# EAGLE schematic 4gewinnt_01 (EAGLE 6.6.0)
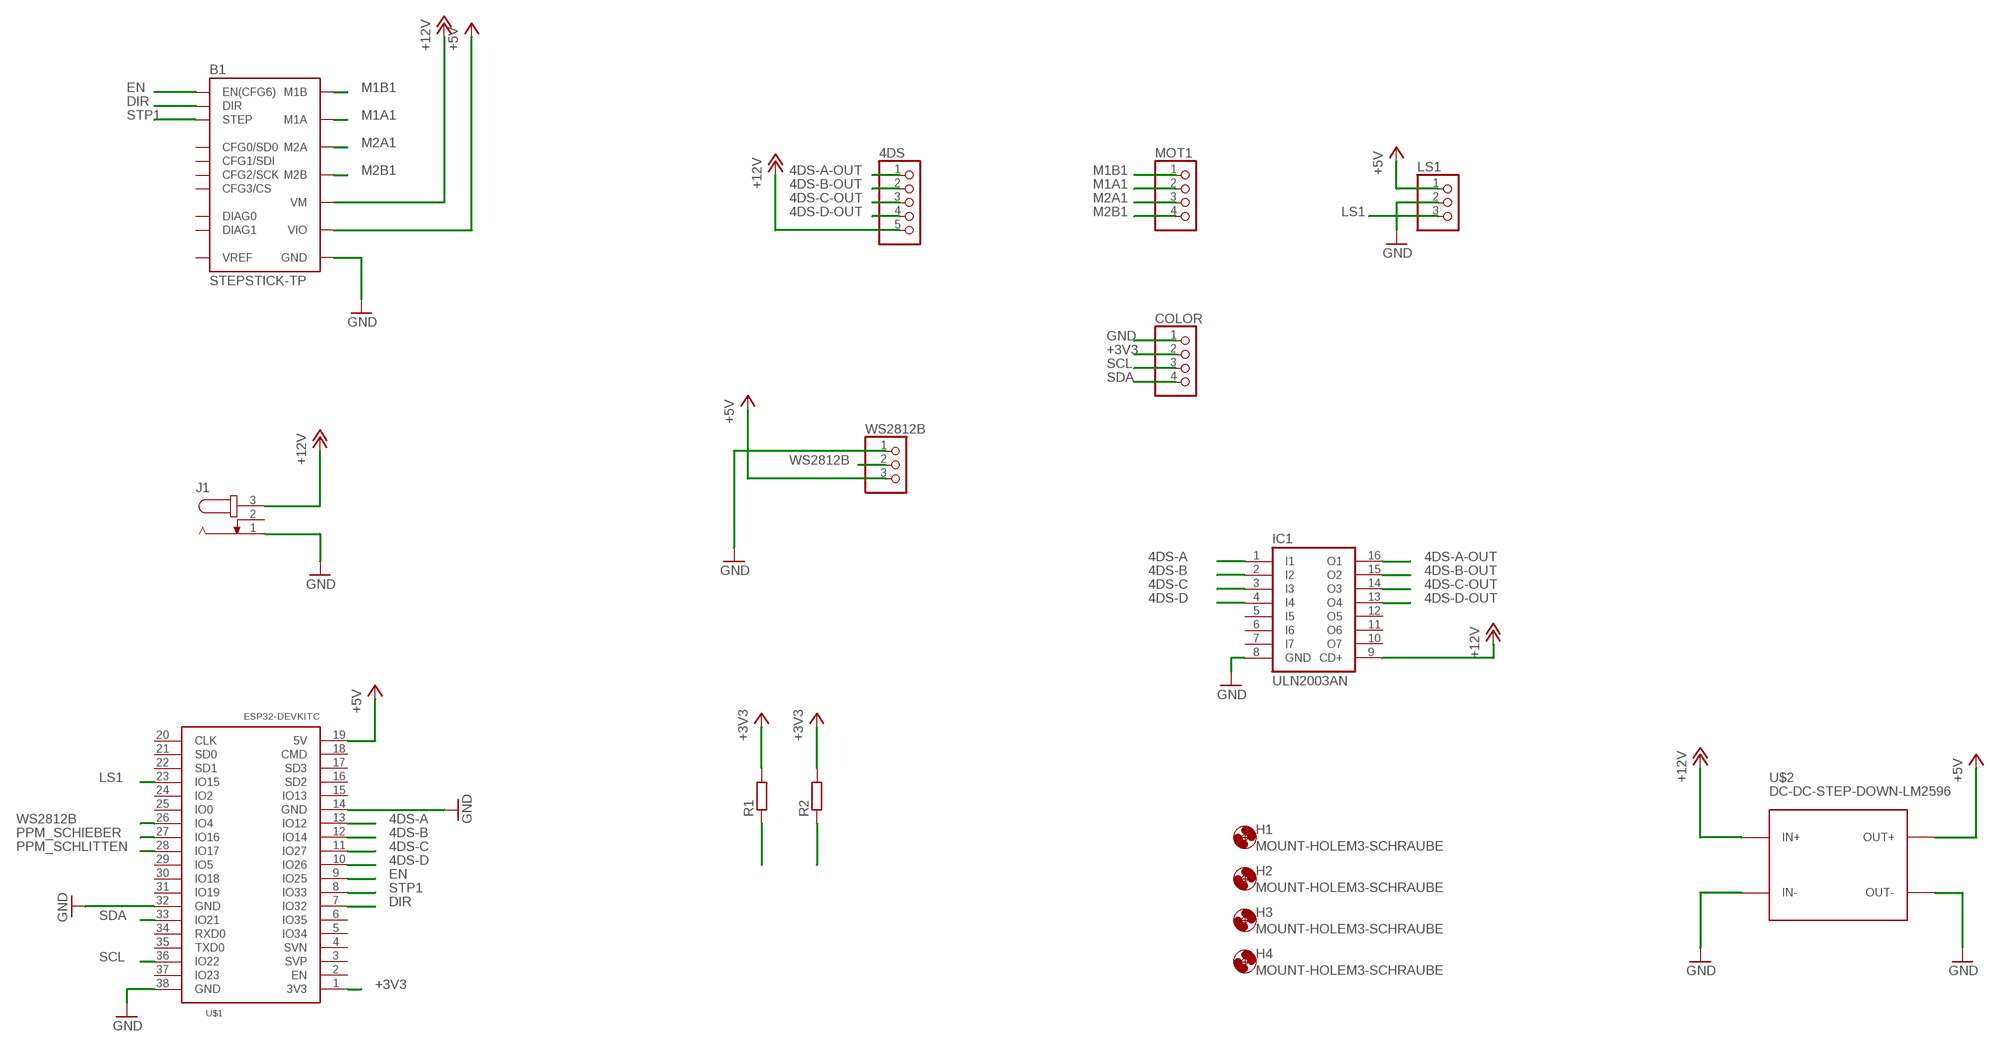
[diagram p0: schematic, sheet 1]

## Parts
4DS  PINHD-1X5  [1X05]
B1  STEPSTICK-TP  [STEPSTICK_TP]
COLOR  PINHD-1X4  [1X04]
H1  MOUNT-HOLEM3-SCHRAUBE  [M3-SCHRAUBE]
H2  MOUNT-HOLEM3-SCHRAUBE  [M3-SCHRAUBE]
H3  MOUNT-HOLEM3-SCHRAUBE  [M3-SCHRAUBE]
H4  MOUNT-HOLEM3-SCHRAUBE  [M3-SCHRAUBE]
IC1  ULN2003AN  [DIL16]
J1  JACK-PLUG2  [DC5.5-2.5]
LS1  PINHD-1X3  [1X03]
MOT1  PINHD-1X4  [1X04]
R1  R-EU_0207/15  [0207/15]
R2  R-EU_0207/15  [0207/15]
U$1  ESP32DEVKITCAZDELIVERY-ESP32  [AZDELIVERY-ESP32]
U$2  DC-DC-STEP-DOWN-LM2596  [DC-DC-STEP-DOWN-LM2596]
WS2812B  PINHD-1X3  [1X03]

## Nets
4DS-A: IC1.1(I1) U$1.13(IO12)
4DS-A-OUT: 4DS.1 IC1.16(O1)
4DS-B: IC1.2(I2) U$1.12(IO14)
4DS-B-OUT: 4DS.2 IC1.15(O2)
4DS-C: IC1.3(I3) U$1.11(IO27)
4DS-C-OUT: 4DS.3 IC1.14(O3)
4DS-D: IC1.4(I4) U$1.10(IO26)
4DS-D-OUT: 4DS.4 IC1.13(O4)
+3V3: COLOR.2 R1.2 R2.2 U$1.1(3V3)
+5V: B1.VIO LS1.1 U$1.19(5V) U$2.OUT+ WS2812B.3
+12V: 4DS.5 B1.VM IC1.9(CD+) J1.3 U$2.IN+
DIR: B1.DIR U$1.7(IO32)
EN: B1.EN(EN(CFG6)) U$1.9(IO25)
GND: B1.GND@1(GND) B1.GND@2(GND) COLOR.1 IC1.8(GND) J1.1 LS1.2 U$1.14(GND) U$1.32(GND) U$1.38(GND) U$2.IN- U$2.OUT- WS2812B.1
LS1: LS1.3 U$1.23(IO15)
M1A1: B1.M1A MOT1.2
M1B1: B1.M1B MOT1.1
M2A1: B1.M2A MOT1.3
M2B1: B1.M2B MOT1.4
PPM_SCHIEBER: R1.1 U$1.27(IO16)
PPM_SCHLITTEN: R2.1 U$1.28(IO17)
SCL: COLOR.3 U$1.36(IO22)
SDA: COLOR.4 U$1.33(IO21)
STP1: B1.STEP U$1.8(IO33)
WS2812B: U$1.26(IO4) WS2812B.2
Unconnected: B1.CFG1(CFG1/SDI) B1.CFG2(CFG2/SCK) B1.CFG3(CFG3/CS) B1.DIAG0 B1.DIAG1 B1.NC/CFG0(CFG0/SD0) B1.VREF IC1.5(I5) IC1.6(I6) IC1.7(I7) IC1.10(O7) IC1.11(O6) IC1.12(O5) J1.2 U$1.2(EN) U$1.3(SVP) U$1.4(SVN) U$1.5(IO34) U$1.6(IO35) U$1.15(IO13) U$1.16(SD2) U$1.17(SD3) U$1.18(CMD) U$1.20(CLK) U$1.21(SD0) U$1.22(SD1) U$1.24(IO2) U$1.25(IO0) U$1.29(IO5) U$1.30(IO18) U$1.31(IO19) U$1.34(RXD0) U$1.35(TXD0) U$1.37(IO23)

## Library data of the parts
4DS = my_pinhead:PINHD-1X5: PIN HEADER
B1 = we-board:STEPSTICK: SilentStepStick - Trinamic TMC2100/TMC2130 Stepper Motor Driver TMC2100 - CFG pins for configuration TMC2130 - SPI for configuration Pin CFG0/SDO only available on TMC2130 SilentStepStick.
COLOR MOT1 = my_pinhead:PINHD-1X4: PIN HEADER
H1-H4 = my_mount:MOUNT-HOLE: MOUNTING HOLE with drill center marker
IC1 = uln-udn:ULN2003A: DRIVER ARRAY
J1 = con-jack:JACK-PLUG: DC POWER JACK Power Jack, DC, Right Angle, Through Hole, Rated 5A at 16VDC, PC Terminals Distributor: Farnell (www.Farnell.de) Drawing: 84N1161.pdf / 84N1162.pdf Manufacturer: SPC Technology (www.spctechnology.com) Type: SPC4077 / SPC 4078
LS1 WS2812B = my_pinhead:PINHD-1X3: PIN HEADER
R1 R2 = my_rcl:R-EU_: RESISTOR, European symbol
U$1 = ESP32-DEVKITC:ESP32DEVKITC
U$2 = diy-modules:DC-DC-STEP-DOWN-LM2596: DC/DC Step-Down Regulator based on LM2596-ADJ chip LM2596 datasheet available here: http://www.ti.com/lit/ds/symlink/lm2596.pdf Click here to find device on ebay.com <http://www.ebay.com/sch/lm2596+power+regulator>